# EAGLE schematic SD_agronautes (EAGLE 6.1)
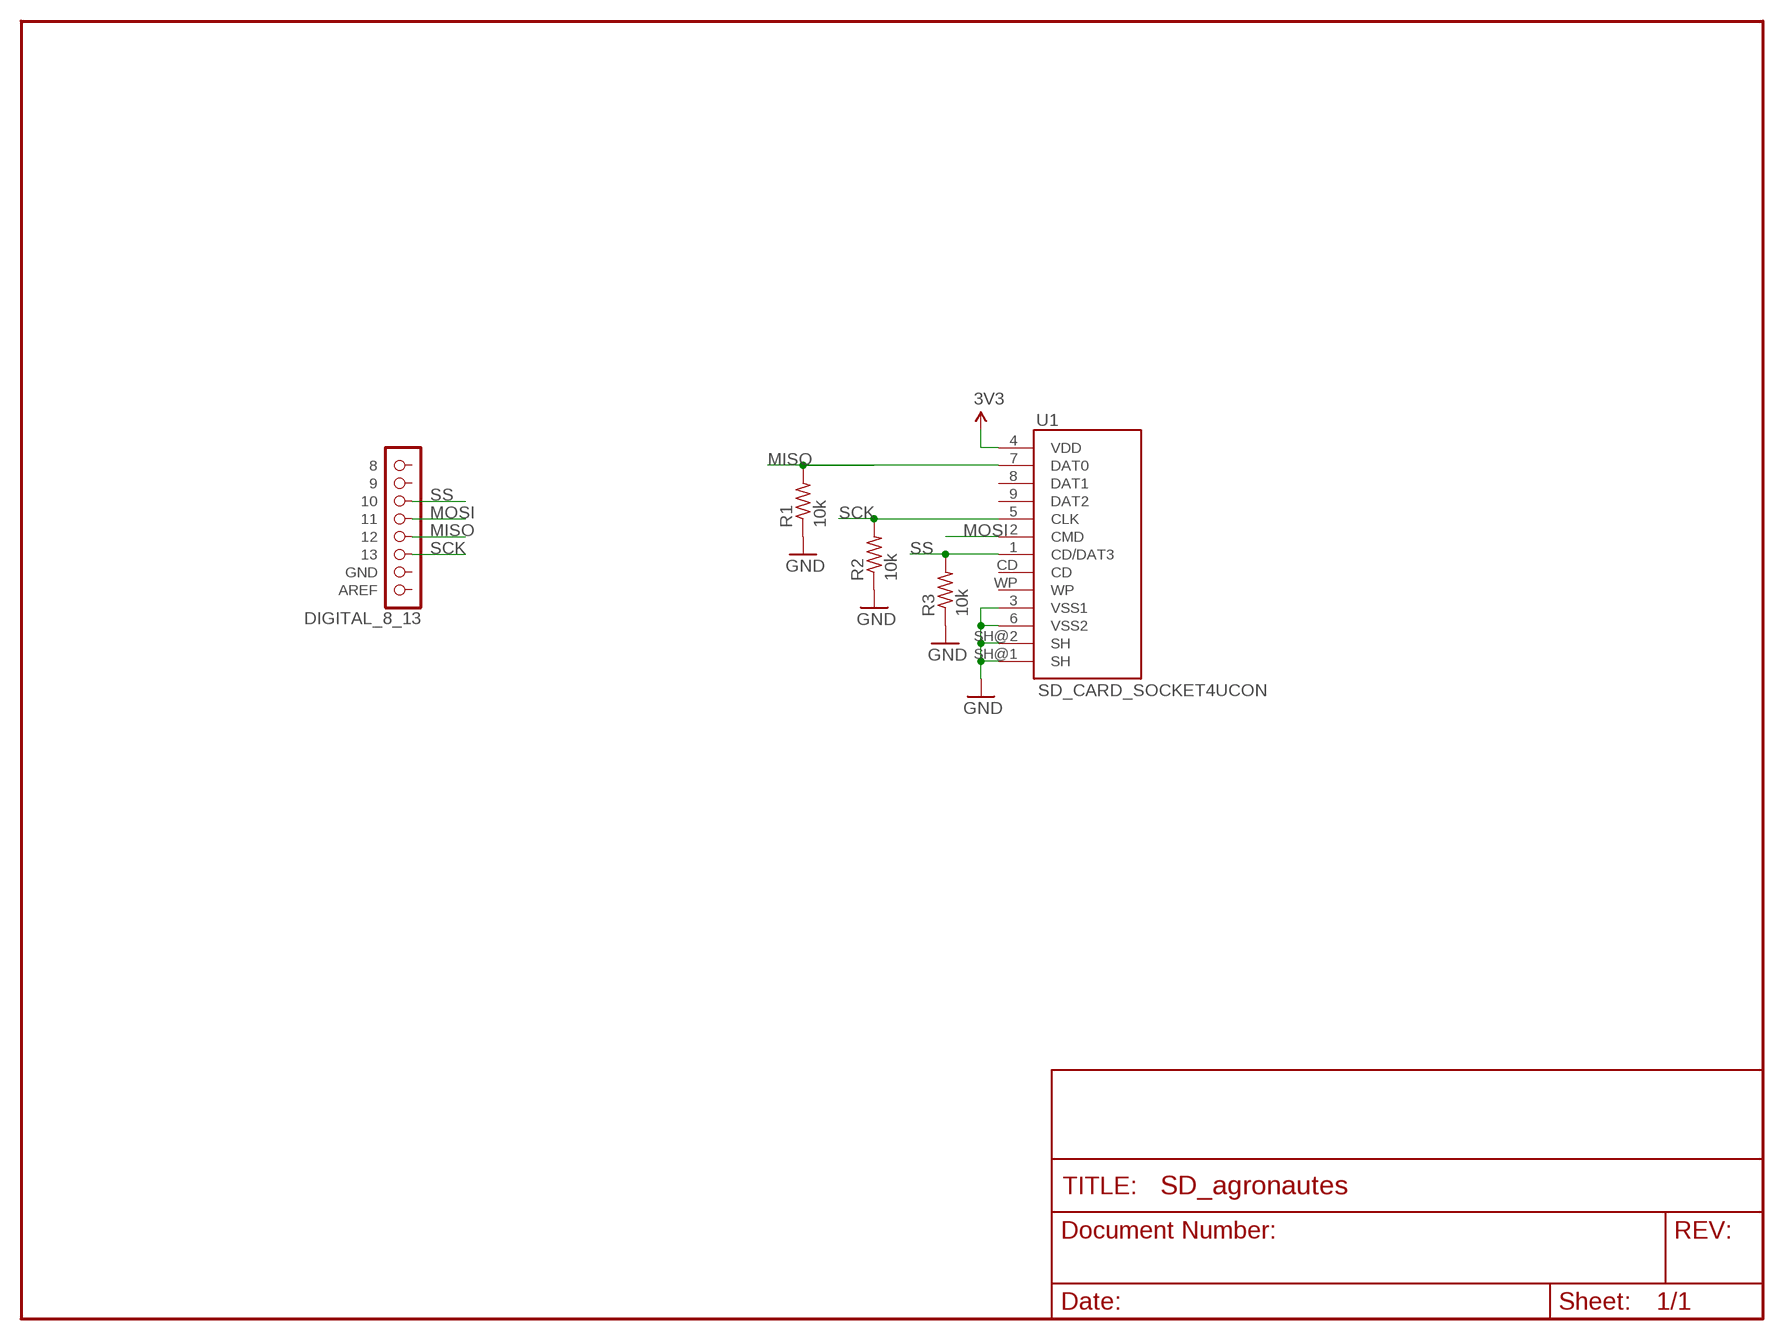
[diagram p0: schematic, sheet 1]

## Parts
R1  10k  R-US_0207/10  [0207/10]
R2  10k  R-US_0207/10  [0207/10]
R3  10k  R-US_0207/10  [0207/10]
U1  SD_CARD_SOCKET4UCON  [SDCARD_4UCONN]
U$2  DIGITAL_8_13  [1X08]

## Nets
GND: R1.1 R2.1 R3.1 U1.3(VSS1) U1.6(VSS2) U1.SH@1(SH) U1.SH@2(SH)
MISO: R1.2 U1.7(DAT0) U$2.4
MOSI: U1.2(CMD) U$2.5
SCK: R2.2 U1.5(CLK) U$2.3
SS: R3.2 U1.1(CD/DAT3) U$2.6
VCC: U1.4(VDD) ; supply symbol labelled 3V3
Unconnected: U1.8(DAT1) U1.9(DAT2) U1.CD U1.WP U$2.1(AREF) U$2.2(GND) U$2.7 U$2.8

## Library data of the parts
R1-R3 = resistor:R-US_: RESISTOR, American symbol
U1 = SparkFun-Connectors:SD_CARD_SOCKET: SD Memory Card Connector, push-push normal type, CD enable, WP enable
U$2 = arduino:DIGITAL_8_13